# Altium schematic sheet Connectors.SchDoc
size A4; SheetNumber: 2; SheetTotal: 5
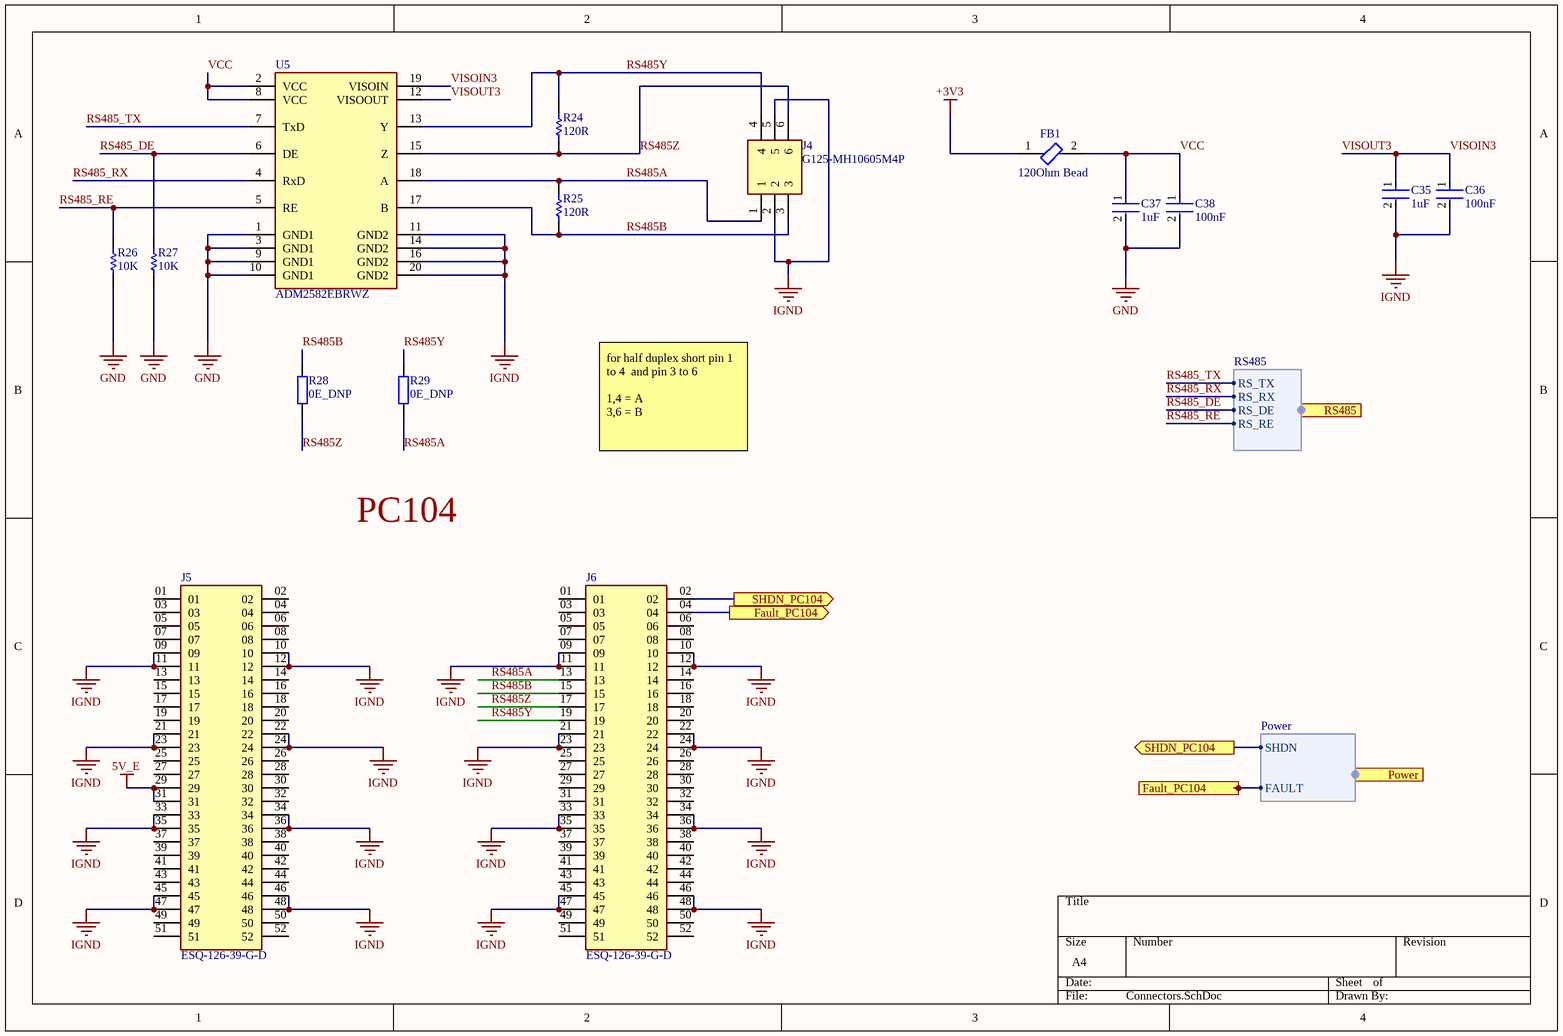
[diagram p0: Connectors.SchDoc]

## Parts
C35  1uF  [CAP0603S]
C36  100nF  [CAP0402S]
C37  1uF  [CAP0603S]
C38  100nF  [CAP0402S]
FB1  120Ohm Bead  [FB0402S]
J4  G125-MH10605M4P  [HARWIN_G125-MH10605M4P]
J5  ESQ-126-39-G-D  [SAMTEC_ESQ-126-39-G-D]
J6  ESQ-126-39-G-D  [SAMTEC_ESQ-126-39-G-D]
R24  120R  [RES0805S]
R25  120R  [RES0805S]
R26  10K  [RES0402S]
R27  10K  [RES0402S]
R28  0E_DNP  [RES0603S]
R29  0E_DNP  [RES0603S]
U5  ADM2582EBRWZ  [SOIC-20]

## Ports
Fault_PC104 (out), Power (harness Power), RS485 (harness RS485), SHDN_PC104 (out)

## Harnesses
RS485: RS_TX, RS_RX, RS_DE, RS_RE
Power: SHDN, FAULT

## Nets
5V_E: J5.29 J5.31
+3V3: FB1.1
GND: C37.2 C38.2 R26.1 R27.1 U5.1(GND1) U5.3(GND1) U5.9(GND1) U5.10(GND1)
IGND: C35.2 C36.2 J4.2 J4.5 J5.09 J5.10 J5.11 J5.12 J5.21 J5.22 J5.23 J5.24 J5.33 J5.34 J5.35 J5.36 J5.45 J5.46 J5.47 J5.48 J6.09 J6.10 J6.11 J6.12 J6.21 J6.22 J6.23 J6.24 J6.33 J6.34 J6.35 J6.36 J6.45 J6.46 J6.47 J6.48 U5.11(GND2) U5.14(GND2) U5.16(GND2) U5.20(GND2)
Fault_PC104: J6.04 ; port Fault_PC104, port Power.FAULT
RS485_DE: R27.2 U5.6(DE) ; port RS485.RS_DE
RS485_RE: R26.2 U5.5(RE) ; port RS485.RS_RE
RS485_RX: U5.4(RxD) ; port RS485.RS_RX
RS485_TX: U5.7(TxD) ; port RS485.RS_TX
RS485A: J4.1 J6.13 R25.2 R29.1 U5.18(A)
RS485B: J4.3 J6.15 R25.1 R28.2 U5.17(B)
RS485Y: J4.4 J6.19 R24.2 R29.2 U5.13(Y)
RS485Z: J4.6 J6.17 R24.1 R28.1 U5.15(Z)
SHDN_PC104: J6.02 ; port SHDN_PC104, port Power.SHDN
VCC: C37.1 C38.1 FB1.2 U5.2(VCC) U5.8(VCC)
VISOIN3: C35.1 C36.1 U5.12(VISOOUT) U5.19(VISOIN)  [also labelled VISOUT3]

Not connected (* = marked no-connect by the designer): J5 01 02 03 04 05 06 07 08 13 14 15 16 17 18 19 20 25 26 27 28 30 32 37 38 39 40 41 42 43 44 49 50 51 52; J6 01 03 05 06 07 08 14 16 18 20 25 26 27 28 29 30 31 32 37 38 39 40 41 42 43 44 49 50 51 52

## Notes on the sheet
- for half duplex short pin 1 to 4  and pin 3 to 6
  1,4 = A
  3,6 = B
- PC104

## Library data of the parts
C35 C37 = 11868f565c42a9108669ba33697ecf6: Ceramic Capacitor General Use 1uF ±10% 50V X7R 0603; Series: M; Width: 0.031inch; Mount: Surface Mount; Radiation Hardening: No; Voltage Rating (DC): 50V; Packaging: Tape and Reel; Termination: SMD/SMT; Depth: 0.8mm; Case Code (Metric): 1608; Case Code (Imperial): 0603; Height: 0.8mm; Voltage Rating: 50V; Package Quantity: 1; Halogen Free: Halogen Free; Dielectric: X7R; Min Operating Temperature: -55°C; Length: 1.6mm; Construction: Flat; Tolerance: 10%; Thickness: 0.037inch; Max Operating Temperature: 125°C; Case/Package: 0603; Capacitance: 1uF; RoHS Compliant: Yes
C36 C38 = b4654b650e69147ec39a6b967a45e02: CAP CER 0.1UF 10V X5R 0402; Manufacturer: Kemet; Manufacturer Part Number: C0402C104K8PACTU; Material: Ceramic; Capacitance: 0.10 μF; Temperature Coefficient: 15%; Tolerance: 0.1; Value: 0.10 μF; Package: C0402-BB; Temperature: -55°C to +125°C; ComponentLink2Description: Datasheet; Temperature Characteristic: X5R; Device Class L1: Passive Components; Height: 0.55mm; Lead Free: Yes; ComponentLink2URL: https://content.kemet.com/datasheets/KEM_C1002_X7R_SMD.pdf; Device Class L2: Capacitors; Temperature Range Low: -55°C; Temperature Range High: +125°C; RoHS: TRUE; Octopart: https://octopart.com/c0402c104k8pactu-kemet-140039; Automotive: No; Mouser Description: Capacitor 100 nF 10 VDC 0402; Category: Cap; Voltage Rating: 10 V; Digikey Description: CAP CER 0.1UF 10V X5R 0402; Ipc Land Pattern Name: CAPC10050X50; Device Class L3: Ceramic Capacitors
FB1 = 5f30dd21d616792df468990f7003faa: FERRITE BEAD 120 OHM 0805 1LN; Number of Lines: 1; DC Resistance-Max: 100mR; Material: Steel; Max DC Current: 200mA; Shielding: Unshielded; Test Frequency: 100MHz; Impedance: 120R; Current Rating: 800mA; Max Current Rating: 1A; Resistance: 150mR; Tolerance: 25%; Width: 1.25mm; Number of Circuits: 1; Military Standard: Not; Height: 0.85mm; Series: BLM21A; Min Operating Temperature: -55°C; DC Resistance (DCR): 100mR; Termination: SMD/SMT; Core Material: Ferrite; REACH SVHC: No SVHC; Radiation Hardening: No; Max Operating Temperature: 125°C; Number of Pins: 2; Case/Package: 0805; Case Code (Imperial): 0805; Frequency: 100MHz; Depth: 1.25mm; Length: 2mm; DC Current: 200mA; Lead Free: Lead Free; Case Code (Metric): 2012; Package Quantity: 1; Packaging: Tape and Reel
J4 = G125-MH10605M4P: Connector; Manufacturer_Name: Harwin; Datasheet Link: https://content.harwin.com/m/667f1be9427fb768/original/DRG-02921-Technical-Drawing-Datasheet-G125-MH1XX05M4P-pdf.pdf; Height: 5.25mm; Manufacturer_Part_Number: G125-MH10605M4P; Mouser Part Number: 855-G125MH1065M4PM4P; Mouser Price/Stock: https://www.mouser.co.uk/ProductDetail/Harwin/G125-MH10605M4P?qs=vHuUswq2%252BswF07IXFR1W6A%3D%3D
J5 J6 = ESQ-126-39-G-D: 52 Position Elevated Socket Connector Through Hole; MF: Samtec; Package: None; MP: ESQ-126-39-G-D; Value: *; Availability: Unavailable; Price: None; SnapEDA_Link: https://www.snapeda.com/parts/ESQ-126-39-G-D/Samtec%20Inc./view-part/490181/?ref=snap
R24 R25 = RES-2: Chip Resistor, 120 Ohm, +/- 1%, 0.125 W, -55 to 155 degC, 0805 (2012 Metric), RoHS, Tape and Reel; Manufacturer: Panasonic; Voltage Rating: 150 V; Mount: Surface Mount; ComponentLink1Description: Manufacturer URL; ComponentLink1URL: http://www.panasonic.com/; RoHSCompliant: true; Min Operating Temperature: -55 degC; Length: 2 mm; Max Operating Temperature: 155 degC; Packaging: Tape and Reel; Package Quantity: 5000; REACH SVHC: Yes; Pins: 2; ComponentLink2Description: Datasheet; DatasheetVersion: 04/2015; PackageReference: 0805; ComponentLink2URL: http://industrial.panasonic.com/cdbs/www-data/pdf/RDA0000/AOA0000C86.pdf; Mounting Technology: Surface Mount; PackageDescription: 2-Pin Surface Mount Device, Body 2 x 1.25 mm; Height: 0.6 mm
R26 R27 = RES-2: Chip Resistor, 10 KOhm, +/- 1%, 0.1 W, -55 to 155 degC, 0402 (1005 Metric), RoHS, Tape and Reel; Manufacturer: Panasonic; Power Rating: 100mW; Voltage Rating: 50V; Resistance: 10KOhm; Case\/Package: 0402; Temperature Coefficient: 100ppm\/degreesC; RoHSCompliant: True; Lead Free: LeadFree; Package Quantity: 1; Contact Plating: Tin; Length: 1mm; Radiation Hardening: No; REACH SVHC: NoSVHC; Max Operating Temperature: 155degC; Depth: 0.5mm; Case Code (Imperial): 0402; Military Standard: Not; Package Description: 2-Pin Surface Mount Device, Body 1 x 0.5 mm; Termination: SMD/SMT; Case Code (Metric): 1005; Height: 0.35mm; Packaging: TapeandReel; Voltage Rating (DC): 50V; Package Reference: 402; Number of Pins: 2; Tolerance: 1%; Mounting Technology: SurfaceMount; Width: 0.02inch; Mount: SurfaceMount; Datasheet URL: https://industrial.panasonic.com/cdbs/www-data/pdf/RDA0000/AOA0000C304.pdf; Composition: ThickFilm; Datasheet Version: 02/2017; Manufacturer URL: http://www.panasonic.com/; Max Power Dissipation: 100mW; Number of Terminations: 2; Min Operating Temperature: -55degC
R28 R29 = RES_0603: Resistor SMD 0603; Manufacturer: *; Manufacturer Part Number: *; Distributor Link: *; LCSC: *
U5 = ADM2582EBRWZ: Isolated Full Duplex RS485 Transreciver